# Altium schematic sheet Top Level.SchDoc
size A4
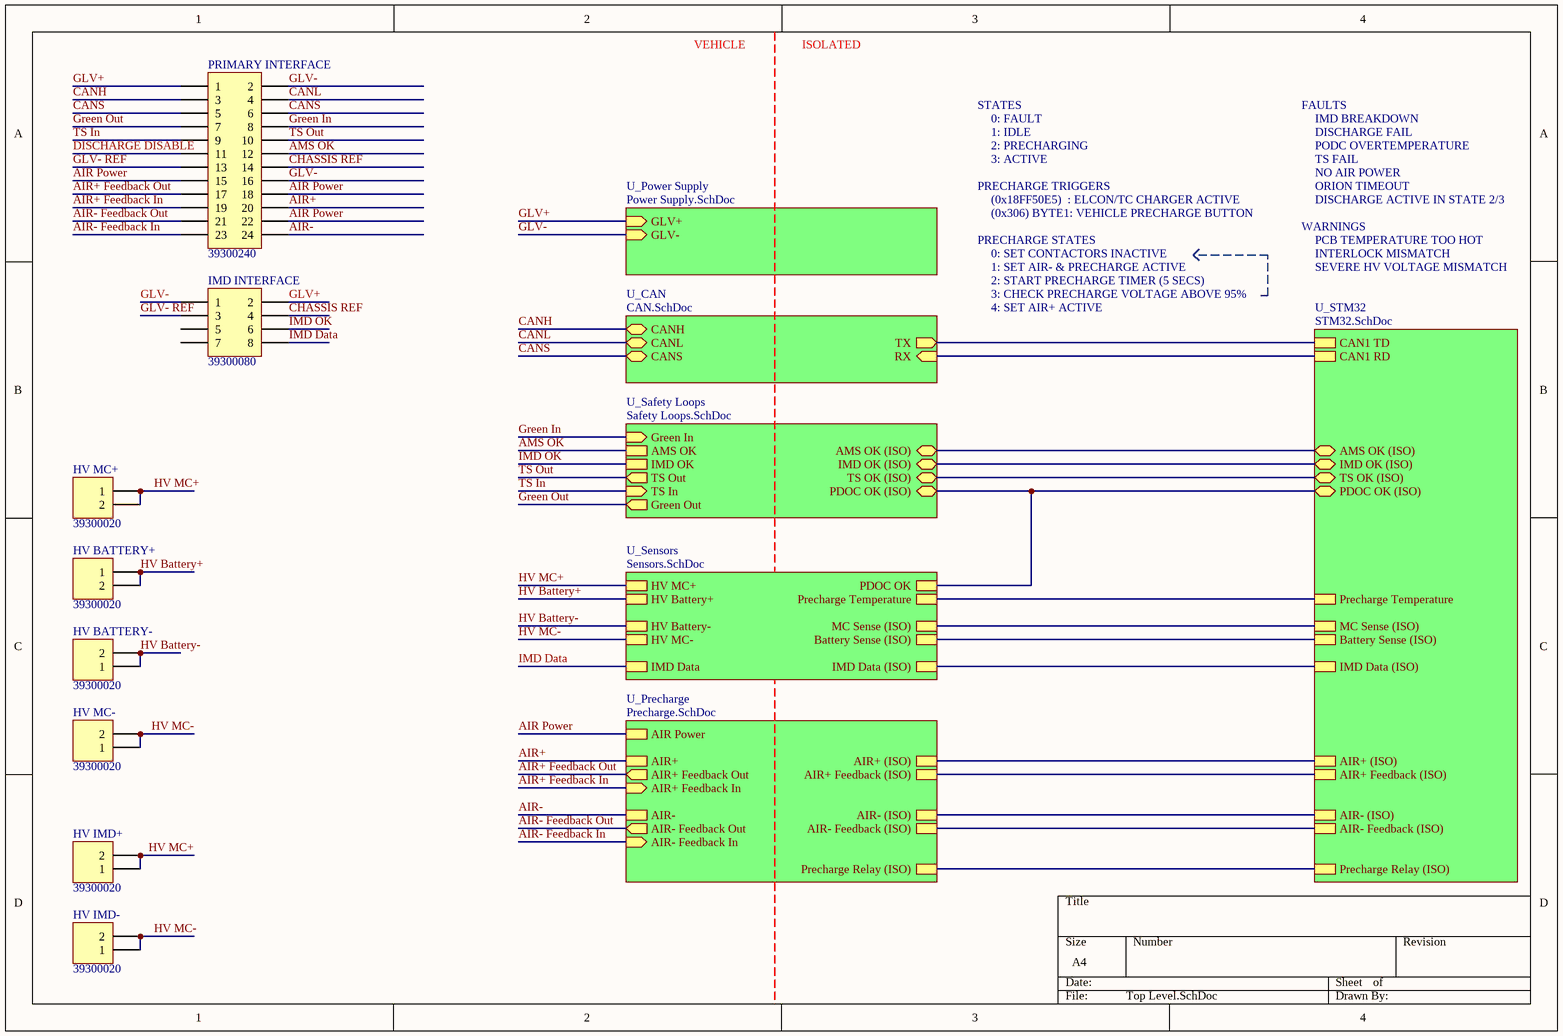
[diagram p0: Top Level.SchDoc]

## Parts
HV_BATTERY+  39300020  [39300020]
HV_BATTERY-  39300020  [39300020]
HV_IMD+  39300020  [39300020]
HV_IMD-  39300020  [39300020]
HV_MC+  39300020  [39300020]
HV_MC-  39300020  [39300020]
IMD_INTERFACE  39300080  [39300080]
PRIMARY_INTERFACE  39300240  [39300240]

## Sub-sheets
U_CAN = CAN.SchDoc: CANH (bidir), CANL (bidir), CANS (bidir), RX (in), TX (out)
U_Power Supply = Power Supply.SchDoc: GLV+ (in), GLV- (in)
U_Precharge = Precharge.SchDoc: AIR Power, AIR- (ISO), AIR- Feedback Out (out), AIR- Feedback (ISO), AIR-, AIR- Feedback In (in), AIR+, AIR+ Feedback Out (out), AIR+ (ISO), AIR+ Feedback (ISO), AIR+ Feedback In (in), Precharge Relay (ISO)
U_Safety Loops = Safety Loops.SchDoc: AMS OK, IMD OK (ISO) (bidir), AMS OK (ISO) (bidir), PDOC OK (ISO) (bidir), TS OK (ISO) (bidir), Green In (in), IMD OK, TS Out (out), TS In (in), Green Out (out)
U_Sensors = Sensors.SchDoc: PDOC OK, HV MC+, HV Battery+, HV MC-, HV Battery-, Precharge Temperature, MC Sense (ISO), Battery Sense (ISO), IMD Data, IMD Data (ISO)
U_STM32 = STM32.SchDoc: CAN1 RD, CAN1 TD, AIR+ (ISO), AIR+ Feedback (ISO), AIR- (ISO), AIR- Feedback (ISO), Precharge Relay (ISO), AMS OK (ISO) (bidir), IMD OK (ISO) (bidir), TS OK (ISO) (bidir), PDOC OK (ISO) (bidir), Precharge Temperature, MC Sense (ISO), Battery Sense (ISO), IMD Data (ISO)

## Nets
AIR Power: PRIMARY_INTERFACE.15 PRIMARY_INTERFACE.18 PRIMARY_INTERFACE.22 ; sheet U_Precharge/AIR Power
AIR+: PRIMARY_INTERFACE.20 ; sheet U_Precharge/AIR+
AIR+ Feedback In: PRIMARY_INTERFACE.19 ; sheet U_Precharge/AIR+ Feedback In
AIR+ Feedback Out: PRIMARY_INTERFACE.17 ; sheet U_Precharge/AIR+ Feedback Out
AIR-: PRIMARY_INTERFACE.24 ; sheet U_Precharge/AIR-
AIR- Feedback In: PRIMARY_INTERFACE.23 ; sheet U_Precharge/AIR- Feedback In
AIR- Feedback Out: PRIMARY_INTERFACE.21 ; sheet U_Precharge/AIR- Feedback Out
AMS OK: PRIMARY_INTERFACE.12 ; sheet U_Safety Loops/AMS OK
CANH: PRIMARY_INTERFACE.3 ; sheet U_CAN/CANH
CANL: PRIMARY_INTERFACE.4 ; sheet U_CAN/CANL
CANS: PRIMARY_INTERFACE.5 PRIMARY_INTERFACE.6 ; sheet U_CAN/CANS
CHASSIS REF: IMD_INTERFACE.4 PRIMARY_INTERFACE.14
DISCHARGE DISABLE: PRIMARY_INTERFACE.11
GLV+: IMD_INTERFACE.2 PRIMARY_INTERFACE.1 ; sheet U_Power Supply/GLV+
GLV-: IMD_INTERFACE.1 PRIMARY_INTERFACE.2 PRIMARY_INTERFACE.16 ; sheet U_Power Supply/GLV-
GLV- REF: IMD_INTERFACE.3 PRIMARY_INTERFACE.13
Green In: PRIMARY_INTERFACE.8 ; sheet U_Safety Loops/Green In
Green Out: PRIMARY_INTERFACE.7 ; sheet U_Safety Loops/Green Out
HV Battery+: HV_BATTERY+.1 HV_BATTERY+.2 ; sheet U_Sensors/HV Battery+
HV Battery-: HV_BATTERY-.1 HV_BATTERY-.2 ; sheet U_Sensors/HV Battery-
HV MC+: HV_IMD+.1 HV_IMD+.2 HV_MC+.1 HV_MC+.2 ; sheet U_Sensors/HV MC+
HV MC-: HV_IMD-.1 HV_IMD-.2 HV_MC-.1 HV_MC-.2 ; sheet U_Sensors/HV MC-
IMD Data: IMD_INTERFACE.8 ; sheet U_Sensors/IMD Data
IMD OK: IMD_INTERFACE.6 ; sheet U_Safety Loops/IMD OK
TS In: PRIMARY_INTERFACE.9 ; sheet U_Safety Loops/TS In
TS Out: PRIMARY_INTERFACE.10 ; sheet U_Safety Loops/TS Out
(unnamed): sheet U_CAN/RX, sheet U_STM32/CAN1 RD
(unnamed): sheet U_CAN/TX, sheet U_STM32/CAN1 TD
(unnamed): sheet U_STM32/AIR+ (ISO), sheet U_Precharge/AIR+ (ISO)
(unnamed): sheet U_STM32/AIR+ Feedback (ISO), sheet U_Precharge/AIR+ Feedback (ISO)
(unnamed): sheet U_STM32/AIR- (ISO), sheet U_Precharge/AIR- (ISO)
(unnamed): sheet U_STM32/AIR- Feedback (ISO), sheet U_Precharge/AIR- Feedback (ISO)
(unnamed): sheet U_STM32/Precharge Relay (ISO), sheet U_Precharge/Precharge Relay (ISO)
(unnamed): sheet U_STM32/AMS OK (ISO), sheet U_Safety Loops/AMS OK (ISO)
(unnamed): sheet U_STM32/IMD OK (ISO), sheet U_Safety Loops/IMD OK (ISO)
(unnamed): sheet U_STM32/TS OK (ISO), sheet U_Safety Loops/TS OK (ISO)
(unnamed): sheet U_STM32/PDOC OK (ISO), sheet U_Safety Loops/PDOC OK (ISO), sheet U_Sensors/PDOC OK
(unnamed): sheet U_STM32/Precharge Temperature, sheet U_Sensors/Precharge Temperature
(unnamed): sheet U_STM32/MC Sense (ISO), sheet U_Sensors/MC Sense (ISO)
(unnamed): sheet U_STM32/Battery Sense (ISO), sheet U_Sensors/Battery Sense (ISO)
(unnamed): sheet U_STM32/IMD Data (ISO), sheet U_Sensors/IMD Data (ISO)

Not connected (* = marked no-connect by the designer): IMD_INTERFACE 5 7

## Notes on the sheet
- VEHICLE
- ISOLATED
- STATES
- FAULTS
- 0: FAULT
- 1: IDLE
- 2: PRECHARGING
- 3: ACTIVE
- IMD BREAKDOWN
- DISCHARGE FAIL
- PODC OVERTEMPERATURE
- TS FAIL
- NO AIR POWER
- PRECHARGE STATES
- PRECHARGE TRIGGERS
- (0x18FF50E5)  : ELCON/TC CHARGER ACTIVE
- (0x306) BYTE1: VEHICLE PRECHARGE BUTTON
- WARNINGS
- PCB TEMPERATURE TOO HOT
- ORION TIMEOUT
- DISCHARGE ACTIVE IN STATE 2/3
- 1: SET AIR- & PRECHARGE ACTIVE
- 2: START PRECHARGE TIMER (5 SECS)
- 3: CHECK PRECHARGE VOLTAGE ABOVE 95%
- 4: SET AIR+ ACTIVE
- 0: SET CONTACTORS INACTIVE
- INTERLOCK MISMATCH
- SEVERE HV VOLTAGE MISMATCH

## Library data of the parts
HV_BATTERY+ HV_BATTERY- HV_IMD+ HV_IMD- HV_MC+ HV_MC- = 39300020: Positions: 2; Pitch: 4.2mm; Row Spacing: 5.5mm; Angle: 90; Flange: No; Contact: Tin; Part Number: 39300020; Digikey Part Number: WM21351-ND
IMD_INTERFACE = 39300080: Positions: 8; Pitch: 4.2mm; Row Spacing: 5.5mm; Angle: 90; Flange: No; Contact: Tin; Part Number: 39300080; Digikey Part Number: WM21354-ND
PRIMARY_INTERFACE = 39300240: Positions: 24; Pitch: 4.2mm; Row Spacing: 5.5mm; Angle: 90; Flange: No; Contact: Tin; Part Number: 39300240; Digikey Part Number: WM21362-ND